# Altium schematic sheet CAN.SchDoc
size A4; SheetNumber: 4; SheetTotal: 5
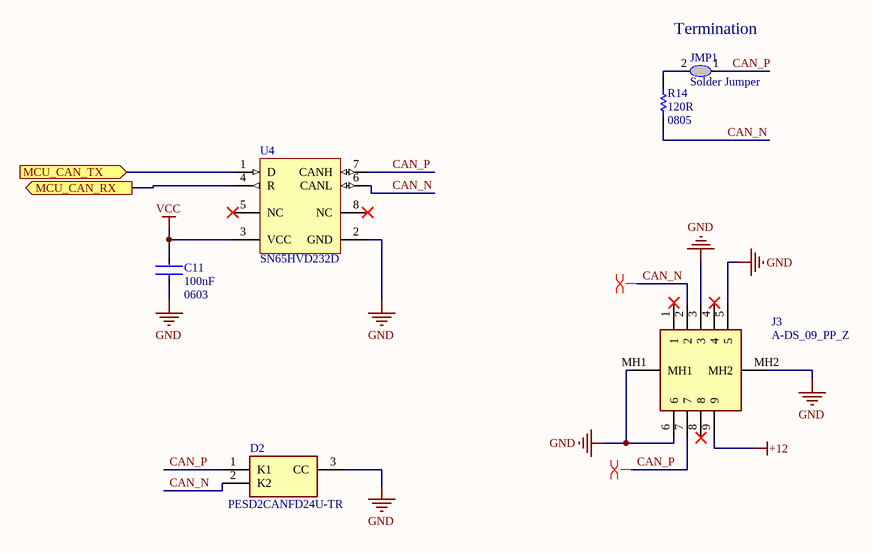
[diagram p0: CAN.SchDoc]

## Parts
C11  Capacitance: 100nF  Case/Package: 0603  [FP-CL10-IPC_A]  (hidden comment: CL10B104KB8WPNC)
D2  PESD2CANFD24U-TR  [SOT95P230X110-3N]
J3  A-DS_09_PP_Z  [ADS09PPZ]
JMP1  Solder Jumper  [Solder Jumper]
R14  Resistance: 120R  Package: 0805  [RESC2013X70X40LL20T20]  (hidden comment: ERJ-P06J121V)
U4  SN65HVD232D  [D0008A_L]

## Ports
MCU_CAN_RX (out), MCU_CAN_TX (in)

## Nets
+12: J3.9
GND: C11.1 D2.3(CC) J3.3 J3.5 J3.6 J3.MH1 J3.MH2 U4.2(GND)
VCC: C11.2 U4.3(VCC)
CAN_N: D2.2(K2) J3.2 R14.2 U4.6(CANL)
CAN_P: D2.1(K1) J3.7 JMP1.1 U4.7(CANH)
MCU_CAN_RX: U4.4(R) ; port MCU_CAN_RX
MCU_CAN_TX: U4.1(D) ; port MCU_CAN_TX
NetJMP1_2: JMP1.2 R14.1

Not connected (* = marked no-connect by the designer): J3 1* 4* 8*; U4 5(NC)* 8(NC)*

## Layout directives
differential pair: CAN_N, CAN_P

## Notes on the sheet
- Termination

## Library data of the parts
C11 = CMP-13271-002353-1: Cap Ceramic 100nF 50V X7R ±10% Pad SMD 0603 +125°C T/R; Ratings: AEC-Q200; Features: Soft Termination; Max Operating Temperature: 125°C; Mount: Surface Mount; Width: 0.031inch; Voltage Rating: 50V; Case Code (Metric): 1608; Case Code (Imperial): 0603; Tolerance: 10%; Min Operating Temperature: -55°C; Thickness: 0.035inch; Lead Free: Lead Free; Packaging: Tape and Reel; Length: 0.063inch
D2 = PESD2CANFD24U-TR: Diode; Manufacturer_Name: Nexperia; Datasheet Link: https://assets.nexperia.com/documents/data-sheet/PESD2CANFD24U-T.pdf; Height: 1.1mm; Manufacturer_Part_Number: PESD2CANFD24U-TR; Mouser Part Number: 771-PESD2CANFD24U-TR; Mouser Price/Stock: https://www.mouser.co.uk/ProductDetail/Nexperia/PESD2CANFD24U-TR?qs=vmHwEFxEFR%252BPr2so13o7KA%3D%3D; Arrow Part Number: PESD2CANFD24U-TR; Arrow Price/Stock: https://www.arrow.com/en/products/pesd2canfd24u-tr/nexperia
J3 = A-DS_09_PP_Z: Connector; Manufacturer_Name: ASSMANN WSW components GmbH; Manufacturer_Part_Number: A-DS 09 PP/Z; Datasheet Link: https://datasheet.datasheetarchive.com/originals/distributors/DKDS-12/220555.pdf; Height: 12.35mm
R14 = CMP-2001-00481-1: Manufacturer: Panasonic; Part Number: ERJ-P06J121V
U4 = CMP-0315-00073-2: 3.3 V CAN Transceiver, 17 mA, -40 to 85 degC, 8-pin SOIC (D), Green (RoHS & no Sb/Br); Manufacturer: Texas Instruments; Supply Voltage(s)(V): 3.3; Transient Pulse Protection(V): -25 to 25; ICC(Max)(mA): 17; Drivers Per Package: 1; Rating: Catalog; Code_JEDEC: MS-012AA; Mounting Technology: Surface Mount; PackageDescription: 8-Pin Plastic Small Outline Integrated Circuit, 4.9 x 3.9 mm, Pitch 1.27 mm Pitch; SubFamily: CAN; PackageVersion: revM, Jun-2011; Isolated: No; DatasheetVersion: SLOS346K; PackageReference: D0008A; Receivers Per Package: 1; Footprint: SN65HVD232; ComponentLink1Description: Datasheet; PartNumber: SN65HVD232D; Eco-Plan: Green (RoHS & no Sb/Br); ComponentLink1URL: http://www.ti.com/general/docs/lit/getliterature.tsp?genericPartNumber=SN65HVD232&fileType=pdf